# Altium schematic sheet 330R Res.schdoc
size 127 x 99 mm
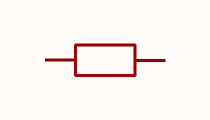
[diagram p0: 330R Res.schdoc]

## Parts
R?  330Ω  [R0402]  (value not drawn)

## Nets

Not connected (* = marked no-connect by the designer): R? 1 2

## Library data of the parts
R? = ERJPA2F3300X: Manufacturer: PANASONIC(松下); Add into BOM: yes; Tolerance: ±1%; Temperature Coefficient: ±100ppm/℃; Symbol: ERJPA2F3300X; Device: ERJPA2F3300X; LCSC Part Name: 330Ω ±1% 200mW 厚膜电阻; Supplier Part: C427237; Manufacturer Part: ERJPA2F3300X; Supplier Footprint: 0402; JLCPCB Part Class: Extended Part; Supplier: LCSC; Convert to PCB: yes; Type: Thick Film Resistors; Value: 330Ω; Overload Voltage (Max): -; Operating Temperature Range: -55℃~+155℃